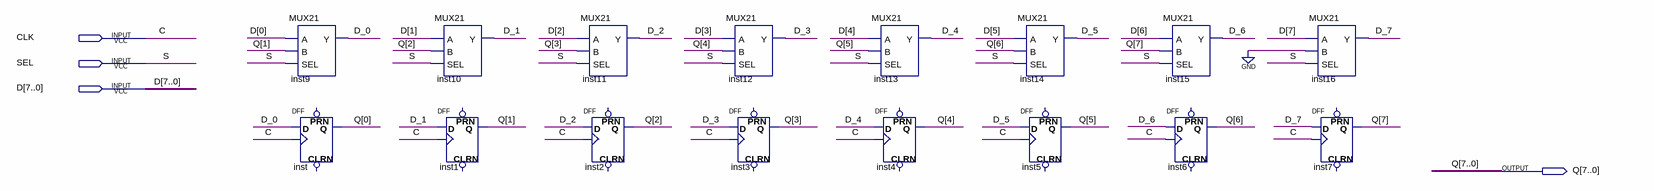
[diagram p0: schematic sheet]
// Quartus schematic SHIFT_RIGHT.bdf as structural Verilog: 16 symbols, 4 pins
module SHIFT_RIGHT (
  input  CLK,
  input  SEL,
  input  [7:0] D,
  output [7:0] Q
);

  wire D_0, D_1, D_2, D_3, D_4, D_5, D_6, D_7;

  MUX21 inst9 (.A(D[0]), .B(Q[1]), .SEL(SEL), .Y(D_0));
  DFF inst (.CLK(CLK), .D(D_0), .Q(Q[0]));  // open: CLRN, PRN
  MUX21 inst10 (.A(D[1]), .B(Q[2]), .SEL(SEL), .Y(D_1));
  DFF inst1 (.CLK(CLK), .D(D_1), .Q(Q[1]));  // open: CLRN, PRN
  MUX21 inst11 (.A(D[2]), .B(Q[3]), .SEL(SEL), .Y(D_2));
  DFF inst2 (.CLK(CLK), .D(D_2), .Q(Q[2]));  // open: CLRN, PRN
  MUX21 inst12 (.A(D[3]), .B(Q[4]), .SEL(SEL), .Y(D_3));
  DFF inst3 (.CLK(CLK), .D(D_3), .Q(Q[3]));  // open: CLRN, PRN
  MUX21 inst13 (.A(D[4]), .B(Q[5]), .SEL(SEL), .Y(D_4));
  DFF inst4 (.CLK(CLK), .D(D_4), .Q(Q[4]));  // open: CLRN, PRN
  MUX21 inst14 (.A(D[5]), .B(Q[6]), .SEL(SEL), .Y(D_5));
  DFF inst5 (.CLK(CLK), .D(D_5), .Q(Q[5]));  // open: CLRN, PRN
  MUX21 inst15 (.A(D[6]), .B(Q[7]), .SEL(SEL), .Y(D_6));
  DFF inst6 (.CLK(CLK), .D(D_6), .Q(Q[6]));  // open: CLRN, PRN
  MUX21 inst16 (.A(D[7]), .B(1'b0), .SEL(SEL), .Y(D_7));
  DFF inst7 (.CLK(CLK), .D(D_7), .Q(Q[7]));  // open: CLRN, PRN

  // Other names for the same wires on the sheet: C = CLK; S = SEL
endmodule
